# EAGLE design LM3404BraceDriver (EAGLE 6.5.0)
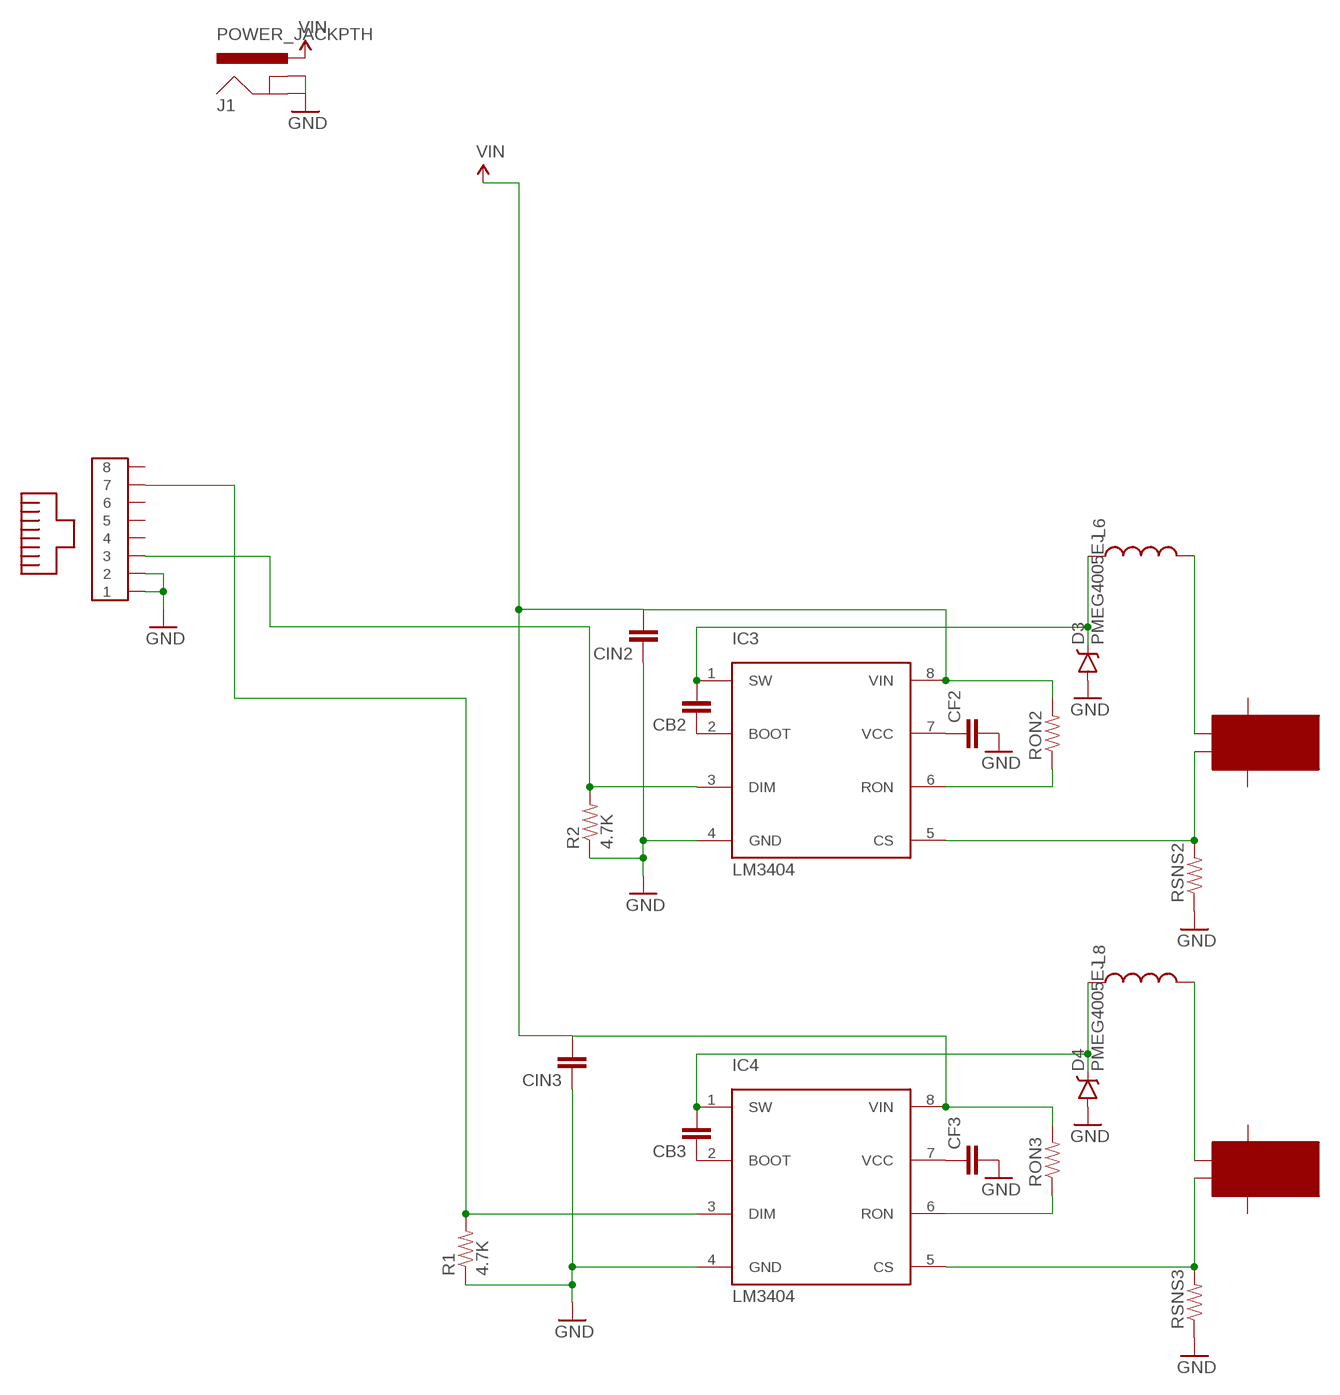
[diagram p0: schematic, sheet 1]

## Parts
CB2  CAP0603-CAP  [0603-CAP]
CB3  CAP0603-CAP  [0603-CAP]
CF2  CAP1206  [1206]
CF3  CAP1206  [1206]
CIN2  CAP1210  [1210]
CIN3  CAP1210  [1210]
D3  PMEG4005EJ  DIODE-SCHOTTKY-PMEG4005EJ  [SOD-323]
D4  PMEG4005EJ  DIODE-SCHOTTKY-PMEG4005EJ  [SOD-323]
IC3  LM3404  [SO8]
IC4  LM3404  [SO8]
J1  POWER_JACKPTH  [POWER_JACK_PTH]
L6  INDUCTORSDR1105  [B82462G]
L8  INDUCTORSDR1105  [B82462G]
R1  4.7K  RESISTOR1206  [1206]
R2  4.7K  RESISTOR1206  [1206]
RON2  RESISTOR1206  [1206]
RON3  RESISTOR1206  [1206]
RSNS2  RESISTOR1206  [1206]
RSNS3  RESISTOR1206  [1206]
U$1  MOLEX-RJ45-SMT  [MOLEX-RJ45-SMT]
U$5  RCA_JACK  [RCA_JACK]
U$6  RCA_JACK  [RCA_JACK]

## Nets
GND: CF2.2 CF3.2 CIN2.1 CIN3.1 D3.A D4.A IC3.4(GND) IC4.4(GND) J1.GND J1.GNDBREAK R1.1 R2.1 RSNS2.1 RSNS3.1 U$1.1 U$1.2
N$15: IC3.3(DIM) R2.2 U$1.3
N$16: CF2.1 IC3.7(VCC)
N$17: CB2.1 IC3.2(BOOT)
N$18: CB2.2 D3.C IC3.1(SW) L6.P$1
N$19: IC3.6(RON) RON2.1
N$20: IC3.5(CS) RSNS2.2 U$6.INNER
N$21: L6.P$2 U$6.SIG
N$22: IC4.3(DIM) R1.2 U$1.7
N$23: CF3.1 IC4.7(VCC)
N$24: CB3.1 IC4.2(BOOT)
N$25: CB3.2 D4.C IC4.1(SW) L8.P$1
N$26: IC4.6(RON) RON3.1
N$27: IC4.5(CS) RSNS3.2 U$5.INNER
N$28: L8.P$2 U$5.SIG
VIN: CIN2.2 CIN3.2 IC3.8(VIN) IC4.8(VIN) J1.PWR RON2.2 RON3.2
Unconnected: U$1.4 U$1.5 U$1.6 U$1.8 U$5.SWA U$5.SWB U$6.SWA U$6.SWB

## Library data of the parts
CB2 CB3 CF2 CF3 CIN2 CIN3 = SparkFun-Capacitors:CAP: Capacitor Standard 0603 ceramic capacitor, and 0.1" leaded capacitor.
D3 D4 = SparkFun-DiscreteSemi:DIODE-SCHOTTKY: Schottky diodes in SFE's production catalog BAT20J 1A 23V 0.62Vf RB751 120mA 40V 0.37Vf PMEG4005EJ 0.5A 40V 0.42Vf MBRA140 1A 40V 0.5Vf B340A 3A 40V SMA; PROD_ID: DIO-10955
IC3 IC4 = LM3404:LM3404
J1 = SparkFun-Connectors:POWER_JACK: Power Jack This is the standard 5.5mm barrel jack for power. The PTH is the most common, proven, reliable, footprint. The Slot footprint only works if the mill layer is transmitted to the PCB fab house so be warned. Mating wall wart : TOL-00298 (and others); PROD_ID: CONN-08197
L6 L8 = Michael-Passives:INDUCTOR: Inductors Basic Inductor/Choke - 0603 and 1206. Footprints are not proven and vary greatly between part numbers. SRN6045- 33uH, 20% 1.4A SDR0403-560KL - 56uH, 10%, 500mA RMS/740mA peak; TEST: test thsi
R1 R2 RON2 RON3 RSNS2 RSNS3 = SparkFun-Resistors:RESISTOR: Resistor Basic schematic elements and footprints for 0603, 1206, and PTH resistors.
U$1 = SMD-RJ45:MOLEX-RJ45-SMT
U$5 U$6 = Michael-Passives:RCA_JACK

## Board
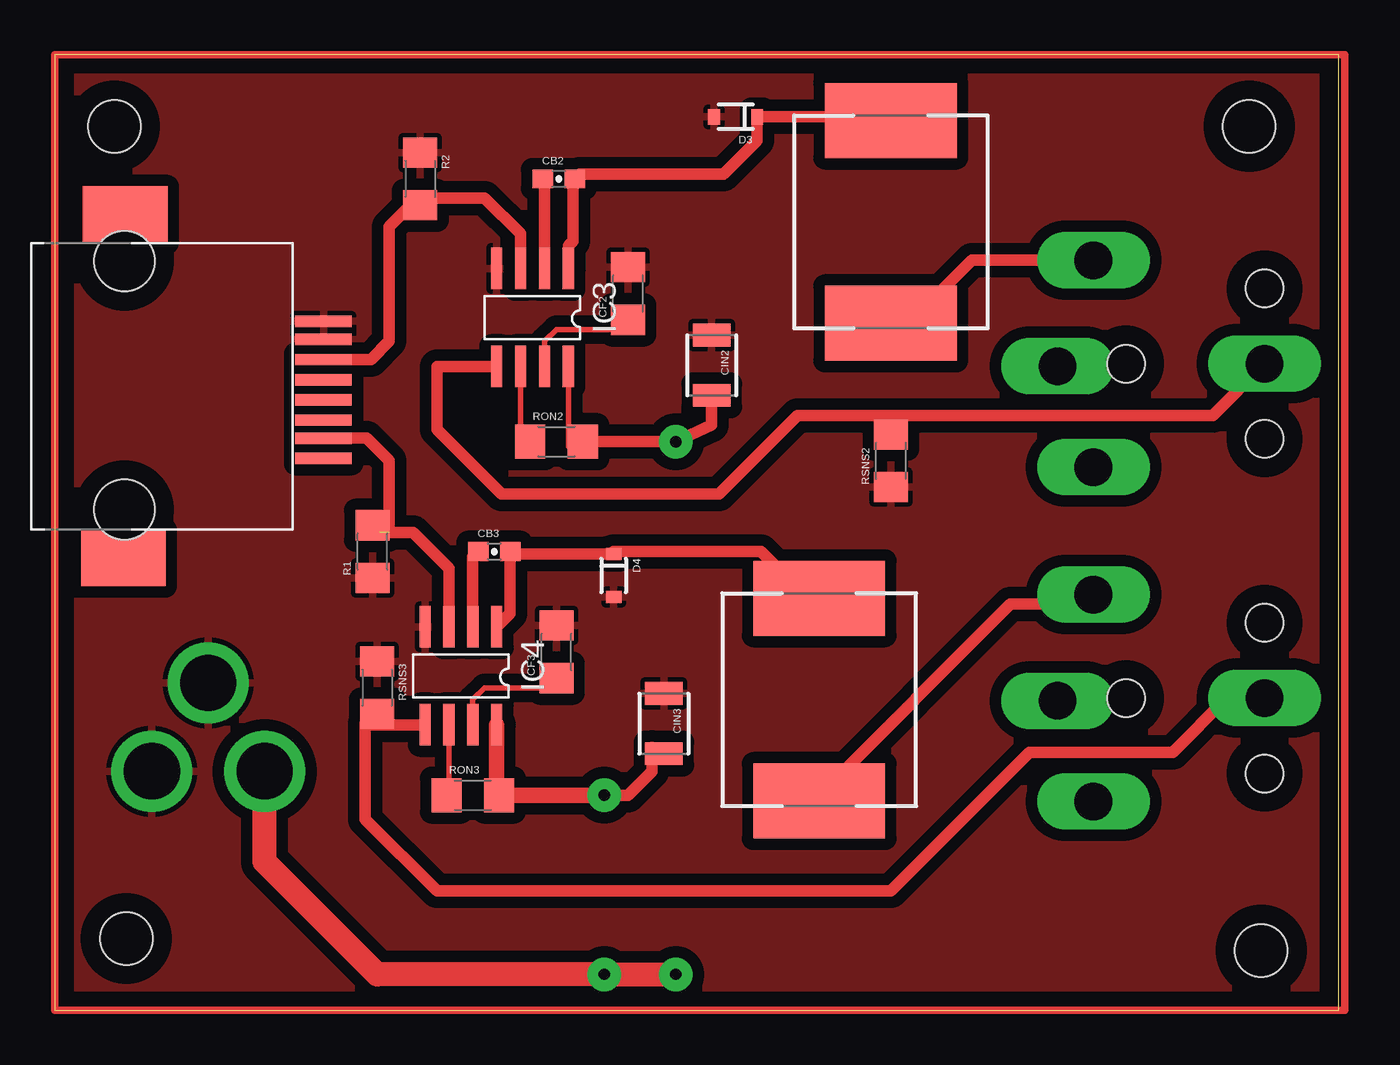
[diagram p1: board, top side]
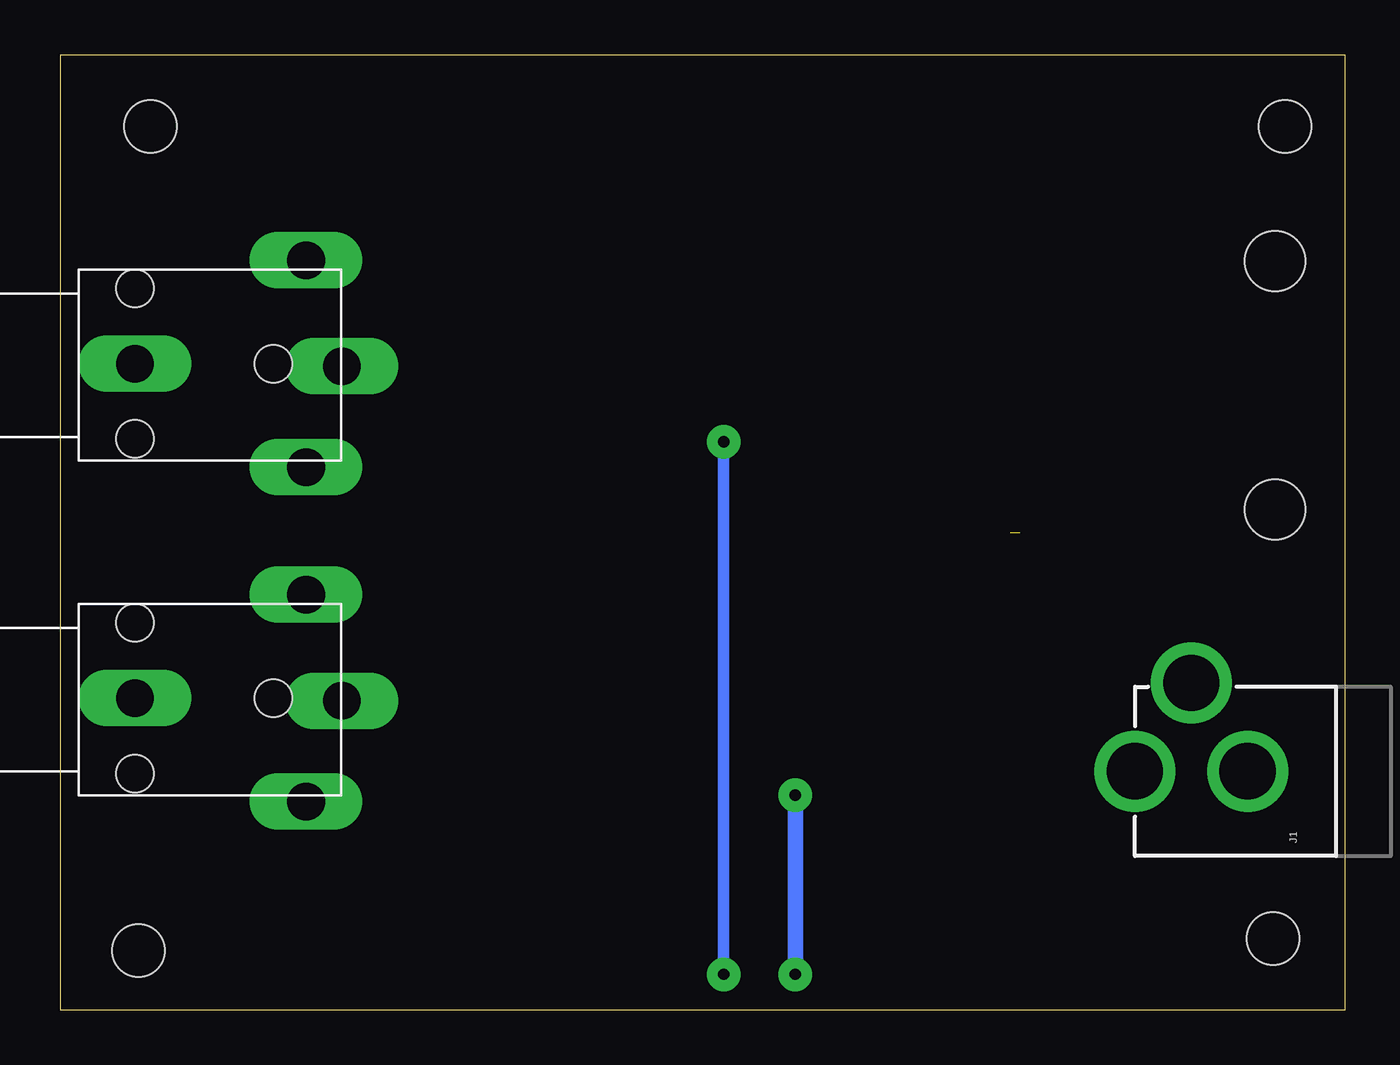
[diagram p2: board, bottom side, seen from below]

Size 68.25 x 50.79 mm. Coordinates in mm from the lower left corner, seen from the top.
Outline: 0,0 68.25,0 68.25,50.79 0,50.79 0,0
Copper layers (1*16): Top 0.035mm / dielectric 1.5mm / Bottom 0.035mm
Design rules "default": minimum track width 10mil, minimum drill 24mil, track to track 8mil, track to pad 8mil, pad to pad 8mil, via to via 8mil, smd to smd 8mil, copper to edge 40mil, drill to drill 8mil, minimum pad ring 10mil, minimum via ring 8mil, stop-mask expansion 4mil, vias tented up to drill 0mil, thermal gap 10mil
Holes 2.8 mm at 63.5,46.99 3.17,46.99 64.14,3.17 3.81,3.81

### Footprints (pad centres in the part's own frame; a part is rotated, then mirrored left to right if it is on the bottom)
0603-CAP = smd 1.1 x 1: 1 -0.85,0; 2 0.85,0
1206 = smd 1.6 x 1.8: 1 -1.4,0; 2 1.4,0
1210 = smd 1.2 x 2: 1 -1.6,0; 2 1.6,0
SOD-323 = smd 0.63 x 0.83: A 1.15,0; C -1.15,0
SO8 = smd 0.6 x 2.2: 1 -1.905,-2.6; 2 -0.635,-2.6; 3 0.635,-2.6; 4 1.905,-2.6; 5 1.905,2.6; 6 0.635,2.6; 7 -0.635,2.6; 8 -1.905,2.6
POWER_JACK_PTH = drill 2.997 pad 4.318: GND 0,7.7; GNDBREAK 4.7,10.7; PWR 0,13.7
B82462G = smd 7.01 x 3.988: P$1 0,5.385; P$2 0,-5.385
MOLEX-RJ45-SMT = smd 3 x 0.6: 1 10.48,3.61; 2 10.48,2.64; 3 10.48,1.57; 4 10.48,0.5; 5 10.48,-0.57; 6 10.48,-1.64; 7 10.48,-2.61; 8 10.48,-3.68 | smd 4.5 x 3: P$1 -0.16,-8.97; P$2 -0.06,9.28 | hole 3.2: -0.1,6.8; -0.1,-6.4
RCA_JACK = drill 2 long: INNER 5,3; SIG -0.5,12.095; SWA 5.135,14; SWB 10.5,12.095 | hole 2: 1,3; 9,3; 5,10.365

### Placement (x,y rotation side)
CB2  26.8,44.2 0 top
CB3  23.37,24.38 0 top
CF2  30.48,38.1 90 top
CF3  26.67,19.05 90 top
CIN2  34.92,34.29 270 top
CIN3  32.38,15.24 270 top
D3  36.2,47.5 180 top
D4  29.72,23.11 270 top
IC3  25.4,36.83 180 top
IC4  21.59,17.78 180 top
J1  -2.54,12.7 90 bottom
L6  44.45,41.91 0 top
L8  40.64,16.51 0 top
R1  16.89,24.38 90 top
R2  19.43,44.2 270 top
RON2  26.67,30.23 0 top
RON3  22.23,11.43 0 top
RSNS2  44.45,29.21 90 top
RSNS3  17.14,17.14 270 top
U$1  3.81,33.02 0 top
U$5  67.31,21.59 270 bottom
U$6  67.31,39.37 270 bottom

### Tracks (layer width: path | path; a pad name or v marks a point on that pad's centre or on a via)
GND
  pour Top (isolate 0.61): 0,50.8 68.58,50.8 68.58,0 0,0
N$15
  Top 0.61: IC3.3 24.77,41.27 22.86,43.18 19.82,43.18 R2.2 18.92,42.8 17.78,41.66 17.78,35.56 16.81,34.59 U$1.3
N$16
  Top 0.305: IC3.7 26.04,35.56 26.67,36.2 29.98,36.2 CF2.1
N$17
  Top 0.61: IC3.2 26.04,44.11 CB2.1
N$18
  Top 0.61: IC3.1 27.3,40.64 27.56,40.89 27.56,44.11 CB2.2 27.9,44.45 35.56,44.45 37.34,46.23 D3.C 44.25,47.5 L6.P$1
N$19
  Top 0.305: IC3.6 24.77,29.71 RON2.1
N$20
  Top 0.61: IC3.5 20.32,34.23 20.32,30.86 23.75,27.43 35.31,27.43 39.5,31.62 44.45,31.62 | U$6.INNER 61.56,31.62 44.45,31.62 | RSNS2.2 44.45,31.62
N$21
  Top 0.61: U$6.SIG 48.76,39.87 45.72,36.83 44.76,36.83 L6.P$2
N$22  (1 unrouted)
  Top 0.61: 17.78,25.4 17.78,29.21 16.58,30.41 U$1.7 | IC4.3 20.95,23.5 19.05,25.4 17.27,25.4 R1.2
N$23
  Top 0.305: IC4.7 22.23,16.51 22.86,17.14 26.16,17.14 CF3.1
N$24
  Top 0.61: IC4.2 22.23,24.09 CB3.1
N$25
  Top 0.61: 41.99,23.25 L8.P$1 40.34,21.59 37.54,24.38 29.72,24.38 D4.C 24.22,24.26 CB3.2 24.22,21.1 IC4.1
N$26
  Top 0.305: IC4.6 20.95,11.56 RON3.1
N$27
  Top 0.305: IC4.5 17.71,15.18 RSNS3.2
  Top 0.61: IC4.5 16.57,15.18 16.51,15.24 16.51,10.16 20.32,6.35 44.45,6.35 51.82,13.72 59.44,13.72 62.31,16.59 U$5.INNER
N$28
  Top 0.305: L8.P$2 39.06,11.43
  Top 0.61: L8.P$2 40.64,11.43 50.8,21.59 55.72,21.59 | 55.88,21.59 55.72,21.59 | 55.72,21.59 U$5.SIG
N$43
  Top 0.406: 0,50.8 0,0 68.58,0 68.58,50.8 0,50.8
VIN  (via drill 0.6 pad 1.78)
  Top 0.305: IC3.8 27.3,29.98 RON2.2 | 24,11.3 24.13,11.43
  Top 0.61: RON2.2 v33.02,30.23 34.92,31.11 CIN2.2 | CIN3.2 32.08,13.64 31.75,13.97 31.75,12.7 30.48,11.43 v29.21,11.43
  Top 0.813: v29.21,11.43 24.13,11.43 RON3.2 23.5,11.56 IC4.8
  Top 1.27: v33.02,1.91 v29.21,1.91 17.14,1.91 11.16,7.89 J1.PWR
  Bottom 0.61: v33.02,30.23 v33.02,1.91
  Bottom 0.813: v29.21,11.43 v29.21,1.91